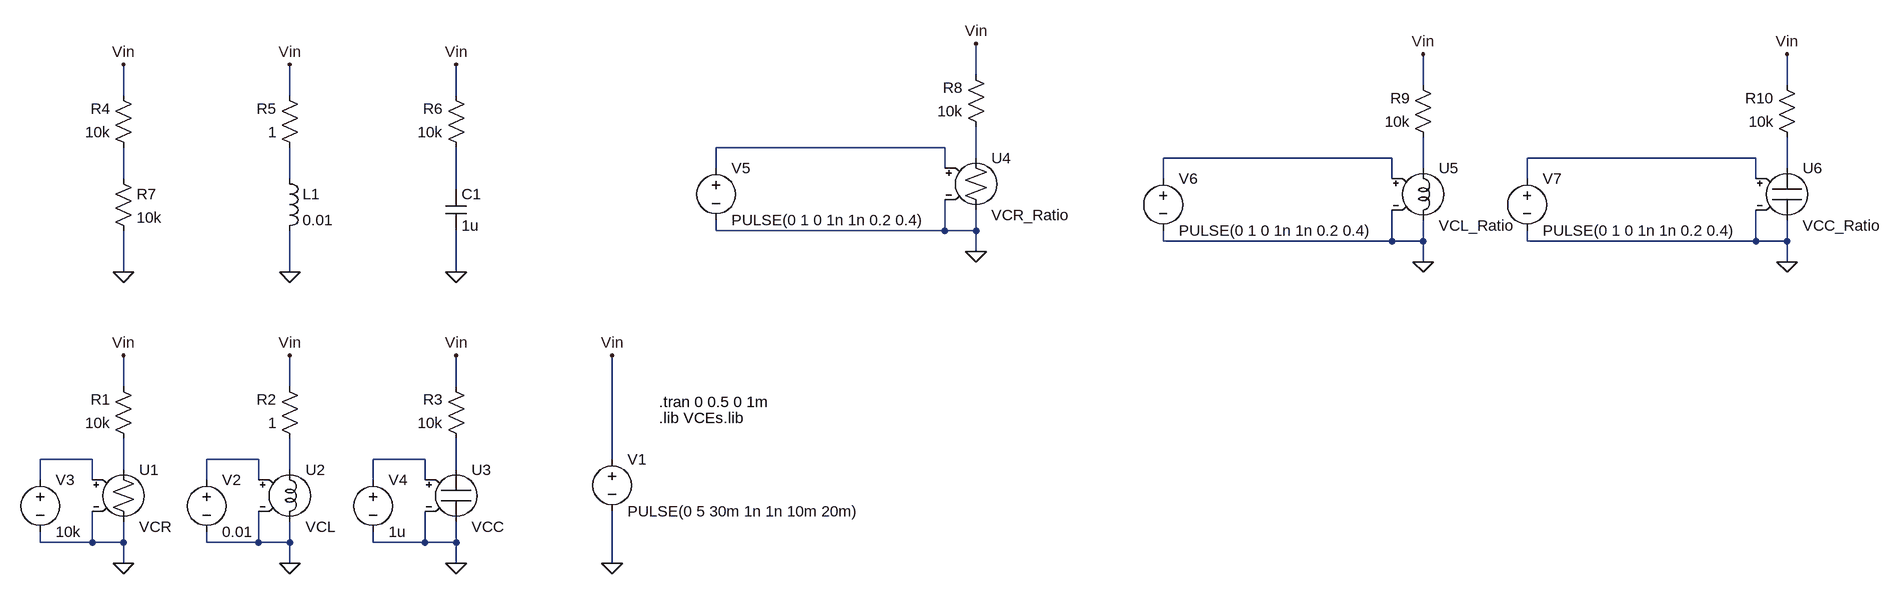
[diagram p0: schematic VCETest.asc]
VCETest.asc, the LTspice schematic file:
Version 4
SHEET 1 3344 680
WIRE 1424 -336 1424 -384
WIRE 2112 -320 2112 -368
WIRE 2672 -320 2672 -368
WIRE 112 -304 112 -352
WIRE 368 -304 368 -352
WIRE 624 -304 624 -352
WIRE 1376 -224 1024 -224
WIRE 1424 -208 1424 -256
WIRE 2064 -208 1712 -208
WIRE 2624 -208 2272 -208
WIRE 1024 -192 1024 -224
WIRE 1376 -192 1376 -224
WIRE 2112 -192 2112 -240
WIRE 2672 -192 2672 -240
WIRE 112 -176 112 -224
WIRE 368 -176 368 -224
WIRE 1712 -176 1712 -208
WIRE 2064 -176 2064 -208
WIRE 2272 -176 2272 -208
WIRE 2624 -176 2624 -208
WIRE 624 -160 624 -224
WIRE 1024 -96 1024 -112
WIRE 1376 -96 1376 -144
WIRE 1376 -96 1024 -96
WIRE 1424 -96 1424 -128
WIRE 1424 -96 1376 -96
WIRE 1712 -80 1712 -96
WIRE 2064 -80 2064 -128
WIRE 2064 -80 1712 -80
WIRE 2112 -80 2112 -112
WIRE 2112 -80 2064 -80
WIRE 2272 -80 2272 -96
WIRE 2624 -80 2624 -128
WIRE 2624 -80 2272 -80
WIRE 2672 -80 2672 -112
WIRE 2672 -80 2624 -80
WIRE 1424 -64 1424 -96
WIRE 2112 -48 2112 -80
WIRE 2672 -48 2672 -80
WIRE 112 -32 112 -96
WIRE 368 -32 368 -96
WIRE 624 -32 624 -96
WIRE 112 144 112 96
WIRE 368 144 368 96
WIRE 624 144 624 96
WIRE 64 256 -16 256
WIRE 320 256 240 256
WIRE 576 256 496 256
WIRE 864 256 864 96
WIRE 112 272 112 224
WIRE 368 272 368 224
WIRE 624 272 624 224
WIRE -16 288 -16 256
WIRE 64 288 64 256
WIRE 240 288 240 256
WIRE 320 288 320 256
WIRE 496 288 496 256
WIRE 576 288 576 256
WIRE -16 384 -16 368
WIRE 64 384 64 336
WIRE 64 384 -16 384
WIRE 112 384 112 352
WIRE 112 384 64 384
WIRE 240 384 240 368
WIRE 320 384 320 336
WIRE 320 384 240 384
WIRE 368 384 368 352
WIRE 368 384 320 384
WIRE 496 384 496 368
WIRE 576 384 576 336
WIRE 576 384 496 384
WIRE 624 384 624 352
WIRE 624 384 576 384
WIRE 112 416 112 384
WIRE 368 416 368 384
WIRE 624 416 624 384
WIRE 864 416 864 336
FLAG 112 416 0
FLAG 864 416 0
FLAG 112 96 Vin
FLAG 368 416 0
FLAG 624 416 0
FLAG 112 -32 0
FLAG 368 -32 0
FLAG 624 -32 0
FLAG 368 96 Vin
FLAG 624 96 Vin
FLAG 864 96 Vin
FLAG 112 -352 Vin
FLAG 368 -352 Vin
FLAG 624 -352 Vin
FLAG 1424 -64 0
FLAG 1424 -384 Vin
FLAG 2112 -48 0
FLAG 2112 -368 Vin
FLAG 2672 -48 0
FLAG 2672 -368 Vin
SYMBOL voltage 864 240 R0
WINDOW 123 0 0 Left 2
WINDOW 39 0 0 Left 2
SYMATTR InstName V1
SYMATTR Value PULSE(0 5 30m 1n 1n 10m 20m)
SYMBOL res 128 240 R180
WINDOW 0 36 76 Left 2
WINDOW 3 36 40 Left 2
SYMATTR InstName R1
SYMATTR Value 10k
SYMBOL VCR 112 272 R0
SYMATTR InstName U1
SYMBOL voltage -16 272 R0
WINDOW 123 0 0 Left 2
WINDOW 39 0 0 Left 2
SYMATTR InstName V3
SYMATTR Value 10k
SYMBOL res 384 240 R180
WINDOW 0 36 76 Left 2
WINDOW 3 36 40 Left 2
SYMATTR InstName R2
SYMATTR Value 1
SYMBOL voltage 240 272 R0
WINDOW 123 0 0 Left 2
WINDOW 39 0 0 Left 2
SYMATTR InstName V2
SYMATTR Value 0.01
SYMBOL res 640 240 R180
WINDOW 0 36 76 Left 2
WINDOW 3 36 40 Left 2
SYMATTR InstName R3
SYMATTR Value 10k
SYMBOL voltage 496 272 R0
WINDOW 123 0 0 Left 2
WINDOW 39 0 0 Left 2
SYMATTR InstName V4
SYMATTR Value 1u
SYMBOL VCL 368 272 R0
SYMATTR InstName U2
SYMBOL VCC 624 272 R0
SYMATTR InstName U3
SYMBOL res 128 -208 R180
WINDOW 0 36 76 Left 2
WINDOW 3 36 40 Left 2
SYMATTR InstName R4
SYMATTR Value 10k
SYMBOL res 384 -208 R180
WINDOW 0 36 76 Left 2
WINDOW 3 36 40 Left 2
SYMATTR InstName R5
SYMATTR Value 1
SYMBOL res 640 -208 R180
WINDOW 0 36 76 Left 2
WINDOW 3 36 40 Left 2
SYMATTR InstName R6
SYMATTR Value 10k
SYMBOL res 96 -192 R0
SYMATTR InstName R7
SYMATTR Value 10k
SYMBOL ind 352 -192 R0
SYMATTR InstName L1
SYMATTR Value 0.01
SYMBOL cap 608 -160 R0
SYMATTR InstName C1
SYMATTR Value 1u
SYMBOL VCR_Ratio 1424 -208 R0
SYMATTR InstName U4
SYMATTR SpiceLine R0=100 R1=10k
SYMBOL res 1440 -240 R180
WINDOW 0 36 76 Left 2
WINDOW 3 36 40 Left 2
SYMATTR InstName R8
SYMATTR Value 10k
SYMBOL voltage 1024 -208 R0
WINDOW 123 0 0 Left 2
WINDOW 39 0 0 Left 2
SYMATTR InstName V5
SYMATTR Value PULSE(0 1 0 1n 1n 0.2 0.4)
SYMBOL res 2128 -224 R180
WINDOW 0 36 76 Left 2
WINDOW 3 36 40 Left 2
SYMATTR InstName R9
SYMATTR Value 10k
SYMBOL voltage 1712 -192 R0
WINDOW 123 0 0 Left 2
WINDOW 39 0 0 Left 2
SYMATTR InstName V6
SYMATTR Value PULSE(0 1 0 1n 1n 0.2 0.4)
SYMBOL VCL_Ratio 2112 -192 R0
SYMATTR InstName U5
SYMBOL res 2688 -224 R180
WINDOW 0 36 76 Left 2
WINDOW 3 36 40 Left 2
SYMATTR InstName R10
SYMATTR Value 10k
SYMBOL voltage 2272 -192 R0
WINDOW 123 0 0 Left 2
WINDOW 39 0 0 Left 2
SYMATTR InstName V7
SYMATTR Value PULSE(0 1 0 1n 1n 0.2 0.4)
SYMBOL VCC_Ratio 2672 -192 R0
SYMATTR InstName U6
SYMATTR SpiceLine C0=1u C1=10u
TEXT 936 168 Left 2 !.tran 0 0.5 0 1m
TEXT 936 192 Left 2 !.lib VCEs.lib

The netlist it stands for:
* VCETest.asc
V1 Vin 0 PULSE(0 5 30m 1n 1n 10m 20m)
R1 N013 Vin 10k
XU1 N013 0 N010 0 VCR  ; pins P+ P- REF+ REF-
V3 N010 0 10k
R2 N014 Vin 1
V2 N011 0 0.01
R3 N015 Vin 10k
V4 N012 0 1u
XU2 N014 0 N011 0 VCL  ; pins P+ P- REF+ REF-
XU3 N015 0 N012 0 VCC  ; pins P+ P- REF+ REF-
R4 N007 Vin 10k
R5 N008 Vin 1
R6 N009 Vin 10k
R7 N007 0 10k
L1 N008 0 0.01
C1 N009 0 1u
XU4 N002 0 N001 0 VCR_Ratio R0=100 R1=10k  ; pins P+ P- REF+ REF-
R8 N002 Vin 10k
V5 N001 0 PULSE(0 1 0 1n 1n 0.2 0.4)
R9 N005 Vin 10k
V6 N003 0 PULSE(0 1 0 1n 1n 0.2 0.4)
XU5 N005 0 N003 0 VCL_Ratio L0=1u L1=100u  ; pins P+ P- REF+ REF-
R10 N006 Vin 10k
V7 N004 0 PULSE(0 1 0 1n 1n 0.2 0.4)
XU6 N006 0 N004 0 VCC_Ratio C0=1u C1=10u  ; pins P+ P- REF+ REF-
.tran 0 0.5 0 1m
.lib VCEs.lib
.backanno
.end